# EAGLE design DAUGHTER_SENSOR_JUMPER (EAGLE 7.6.0)
DAUGHTER CARD SENSOR JUMPER
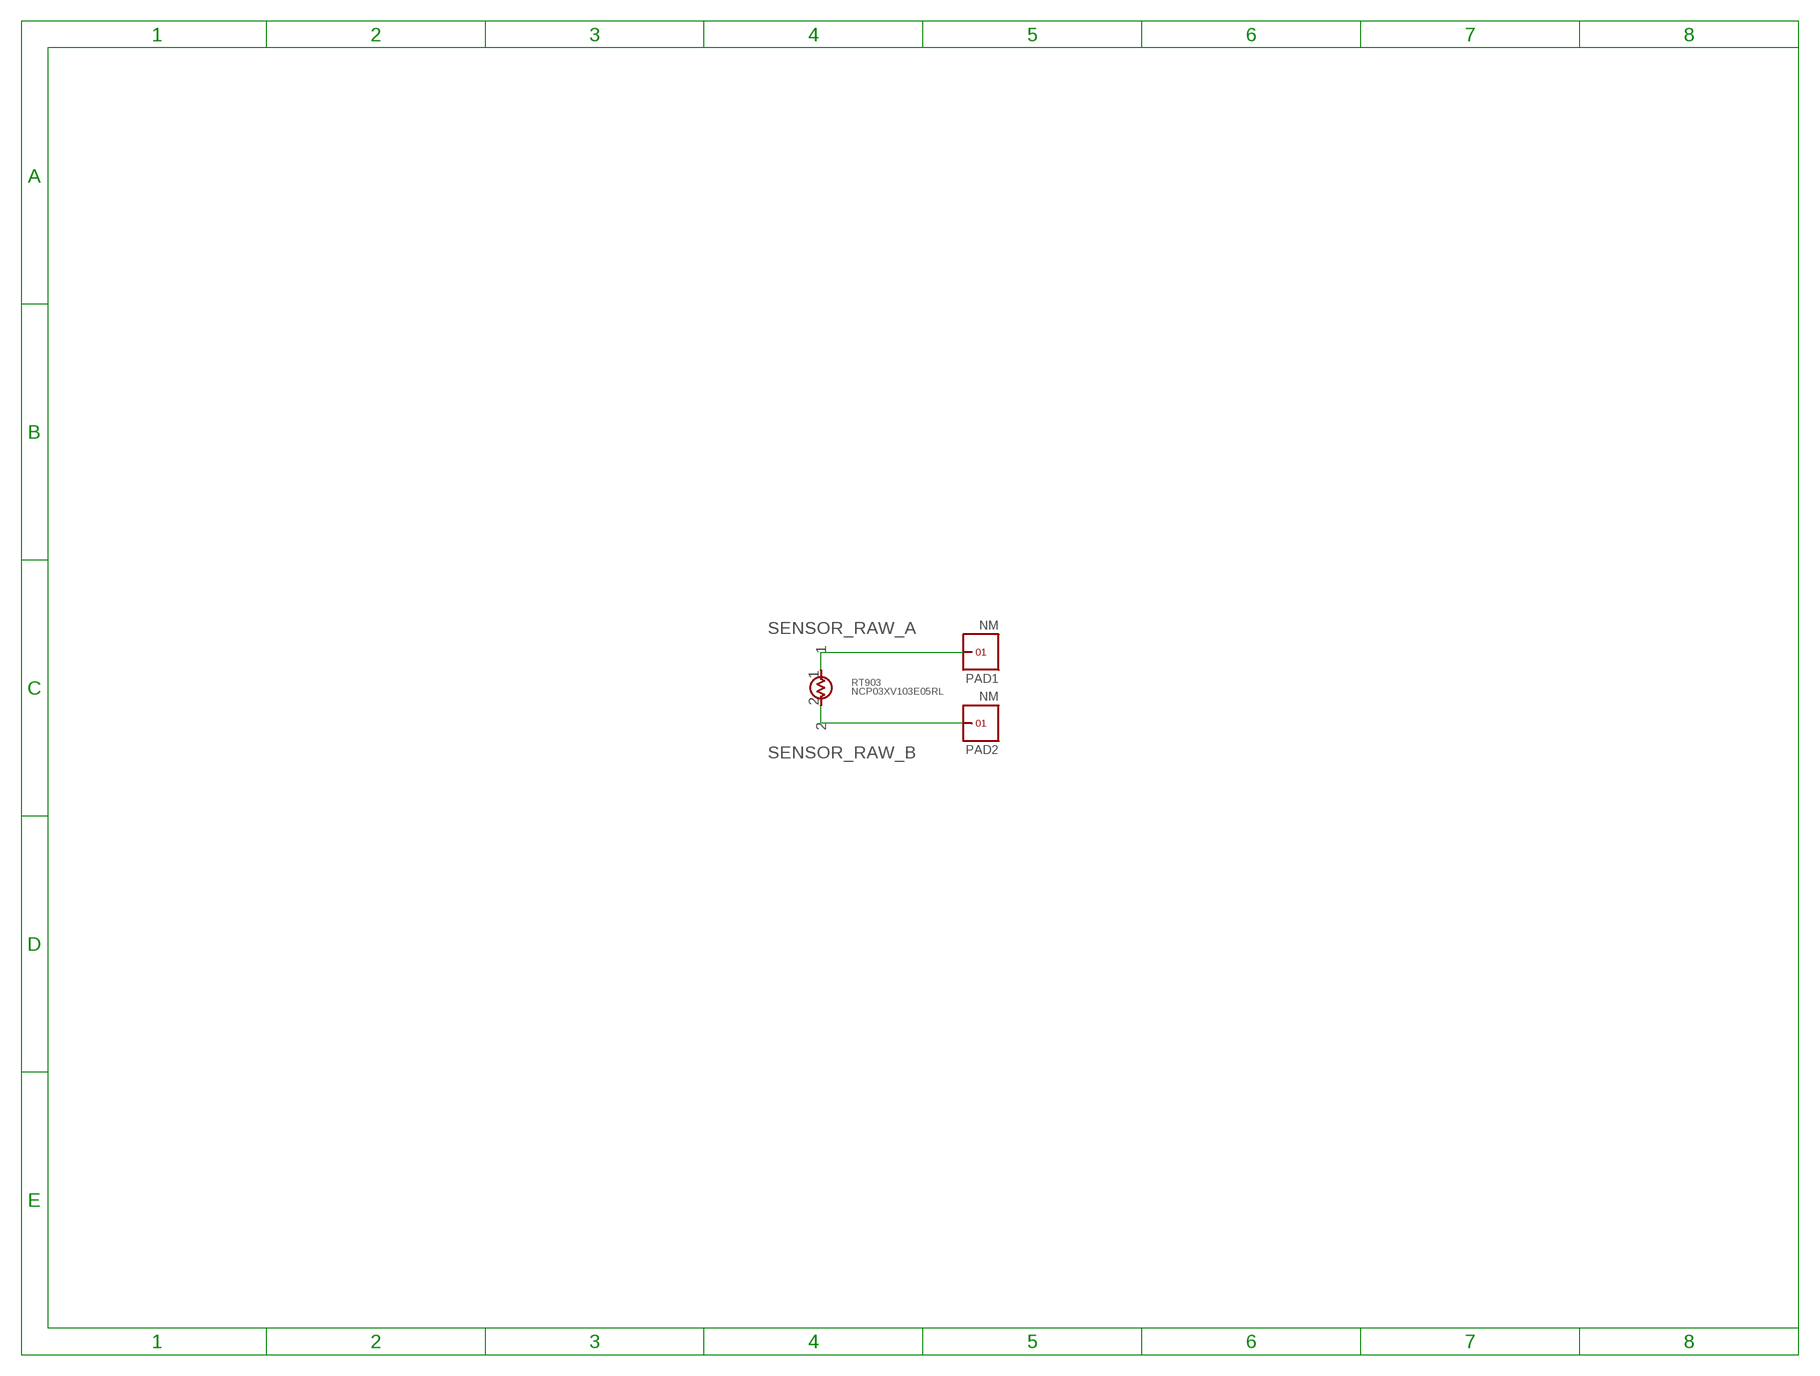
[diagram p0: schematic, sheet 1]

## Parts
PAD1  NM  PUCK  [PAD_2X3]
PAD2  NM  PUCK  [PAD_2X3]
RT903  NCP03XV103E05RL  THERMISTOR  [0201]

## Nets
SENSOR_RAW_A: PAD1.1 RT903.1
SENSOR_RAW_B: PAD2.1 RT903.2

## Library data of the parts
PAD1 PAD2 = MOTO_LIB:PUCK: test pad
RT903 = MOTO_LIB:THERMISTOR: Thmistor, NTC 10Khm 3%, 0201; MPN: NCP03XV103XV103E05RL/NTCG0603UH103HT; SUPPLIER: MURARA/TDK

## Board
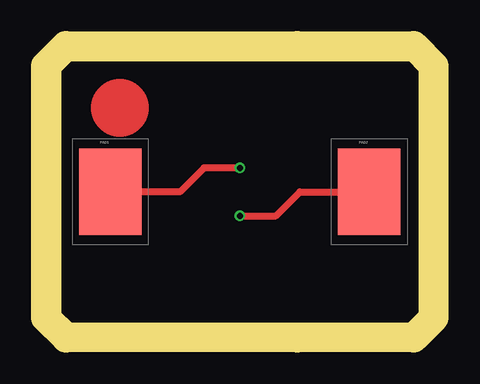
[diagram p1: board, top side]
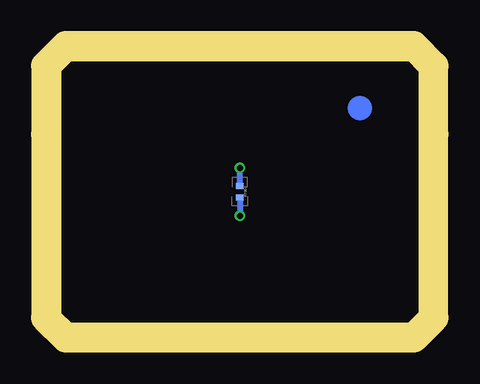
[diagram p2: board, bottom side, seen from below]

Size 15 x 11 mm. Coordinates in mm from the lower left corner, seen from the top.
Outline: 15,10.75 14.75,11 0.25,11 0,10.75 0,0.25 0.25,0 14.75,0 15,0.25 15,10.75
Copper layers (1*16): Top 0.03mm / dielectric 0.787mm / Bottom 0.03mm
Design rules "constraint *": minimum track width 0.08mm, minimum drill 0.25mm, track to track 0.08mm, track to pad 0.08mm, pad to pad 0.08mm, via to via 0.08mm, smd to smd 0.08mm, copper to edge 0.2mm, drill to drill 0.2mm, minimum pad ring 0.1mm, minimum via ring 0.1mm, stop-mask expansion 0mil, vias tented up to drill 0.25mm, thermal gap 0mil
Milling: 12 lines

### Footprints (pad centres in the part's own frame; a part is rotated, then mirrored left to right if it is on the bottom)
PAD_2X3 = smd 2.6 x 3.6: 1 0,0
0201 = smd 0.25 x 0.3: 1 -0.23,0; 2 0.23,0

### Placement (x,y rotation side)
PAD1  2.1,5.5 0 top
PAD2  12.9,5.5 0 top
RT903  7.5,5.5 270 bottom

### Tracks (layer width: path | path; a pad name or v marks a point on that pad's centre or on a via)
SENSOR_RAW_A  (via drill 0.25)
  Top 0.3: v7.5,6.5 6,6.5 5,5.5 PAD1.1
  Bottom 0.25: RT903.1 v7.5,6.5
SENSOR_RAW_B  (via drill 0.25)
  Top 0.3: v7.5,4.5 9,4.5 10,5.5 PAD2.1
  Bottom 0.25: RT903.2 v7.5,4.5
(copper drawn outside any net)
  shapes: Bottom circle x1, Top circle x1